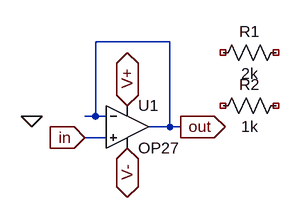
[diagram p0: schematic buffer_amplifier.asc]
buffer_amplifier.asc, the LTspice schematic file:
Version 4.1
SHEET 1 880 680
WIRE 272 32 160 32
WIRE 160 144 160 32
WIRE 160 144 144 144
WIRE 176 144 160 144
WIRE 272 160 272 32
WIRE 272 160 240 160
WIRE 288 160 272 160
WIRE 176 176 144 176
FLAG 288 160 out
IOPIN 288 160 Out
FLAG 144 176 in
IOPIN 144 176 In
FLAG 208 128 V+
IOPIN 208 128 BiDir
FLAG 208 192 V-
IOPIN 208 192 BiDir
FLAG 64 144 0
SYMBOL OpAmps\\OP27 208 96 R0
SYMATTR InstName U1
SYMBOL res 336 64 R270
WINDOW 0 32 56 VTop 2
WINDOW 3 0 56 VBottom 2
SYMATTR InstName R1
SYMATTR Value 2k
SYMBOL res 448 112 R90
WINDOW 0 0 56 VBottom 2
WINDOW 3 32 56 VTop 2
SYMATTR InstName R2
SYMATTR Value 1k

The netlist it stands for:
* buffer_amplifier.asc
X§U1 in out V+ V- out OP27  ; pins In+ In- V+ V- OUT
R1 NC_01 NC_02 2k
R2 NC_03 NC_04 1k
.lib ADI.lib
.backanno
.end